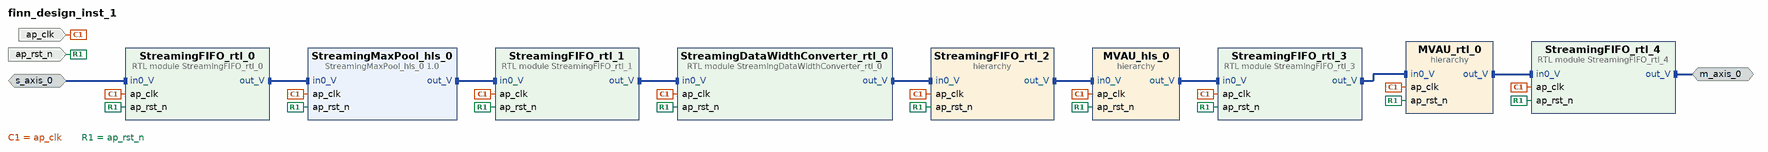
[diagram p0: block diagram of the top level]
# Vivado block design finn_design_inst_1, xc7z020clg400-1, Vivado 2022.2
create_bd_design finn_design_inst_1

create_bd_intf_port -mode Slave -vlnv xilinx.com:interface:axis_rtl:1.0 s_axis_0
create_bd_intf_port -mode Master -vlnv xilinx.com:interface:axis_rtl:1.0 m_axis_0
create_bd_port -dir I -type clk ap_clk
create_bd_port -dir I -type rst ap_rst_n

create_bd_cell -type module -reference StreamingFIFO_rtl_0 StreamingFIFO_rtl_0
create_bd_cell -type ip -vlnv xilinx.com:hls:StreamingMaxPool_hls_0:1.0 StreamingMaxPool_hls_0
create_bd_cell -type module -reference StreamingFIFO_rtl_1 StreamingFIFO_rtl_1
create_bd_cell -type module -reference StreamingDataWidthConverter_rtl_0 StreamingDataWidthConverter_rtl_0
create_bd_cell -type hier StreamingFIFO_rtl_2
create_bd_cell -type hier MVAU_hls_0
create_bd_cell -type module -reference StreamingFIFO_rtl_3 StreamingFIFO_rtl_3
create_bd_cell -type hier MVAU_rtl_0
create_bd_cell -type module -reference StreamingFIFO_rtl_4 StreamingFIFO_rtl_4

# ---- hierarchy /StreamingFIFO_rtl_2 ----
current_bd_instance /StreamingFIFO_rtl_2
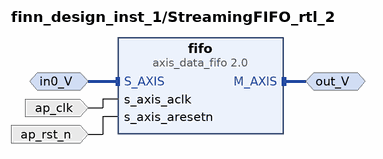
[diagram p1: block diagram inside /StreamingFIFO_rtl_2]
create_bd_intf_pin -mode Master -vlnv xilinx.com:interface:axis_rtl:1.0 out_V
create_bd_intf_pin -mode Slave -vlnv xilinx.com:interface:axis_rtl:1.0 in0_V
create_bd_pin -dir I -type clk ap_clk
create_bd_pin -dir I -type rst ap_rst_n

create_bd_cell -type ip -vlnv xilinx.com:ip:axis_data_fifo:2.0 fifo
set_property -dict {CONFIG.FIFO_DEPTH 512 CONFIG.FIFO_MEMORY_TYPE auto CONFIG.TDATA_NUM_BYTES 8} [get_bd_cells fifo]

# ---- hierarchy /MVAU_hls_0 ----
current_bd_instance /MVAU_hls_0
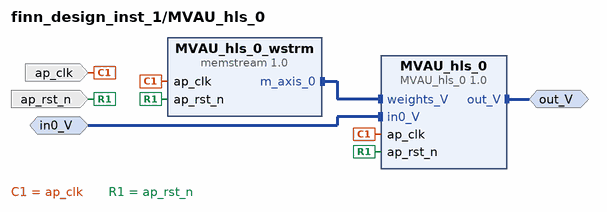
[diagram p2: block diagram inside /MVAU_hls_0]
create_bd_intf_pin -mode Master -vlnv xilinx.com:interface:axis_rtl:1.0 out_V
create_bd_intf_pin -mode Slave -vlnv xilinx.com:interface:axis_rtl:1.0 in0_V
create_bd_pin -dir I -type clk ap_clk
create_bd_pin -dir I -type rst ap_rst_n

create_bd_cell -type ip -vlnv xilinx.com:hls:MVAU_hls_0:1.0 MVAU_hls_0
create_bd_cell -type ip -vlnv amd.com:finn:memstream:1.0 MVAU_hls_0_wstrm
set_property -dict [list \
  CONFIG.DEPTH 12544 \
  CONFIG.INIT_FILE /tmp/finn_dev_andreea/code_gen_ipgen_MVAU_hls_0_wm2359pm/memblock.dat \
  CONFIG.RAM_STYLE auto \
  CONFIG.WIDTH 64 \
] [get_bd_cells MVAU_hls_0_wstrm]

# ---- hierarchy /MVAU_rtl_0 ----
current_bd_instance /MVAU_rtl_0
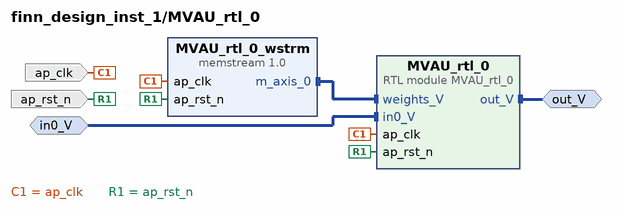
[diagram p3: block diagram inside /MVAU_rtl_0]
create_bd_intf_pin -mode Master -vlnv xilinx.com:interface:axis_rtl:1.0 out_V
create_bd_intf_pin -mode Slave -vlnv xilinx.com:interface:axis_rtl:1.0 in0_V
create_bd_pin -dir I -type clk ap_clk
create_bd_pin -dir I -type rst ap_rst_n

create_bd_cell -type module -reference MVAU_rtl_0 MVAU_rtl_0
create_bd_cell -type ip -vlnv amd.com:finn:memstream:1.0 MVAU_rtl_0_wstrm
set_property -dict [list \
  CONFIG.DEPTH 320 \
  CONFIG.INIT_FILE /tmp/finn_dev_andreea/code_gen_ipgen_MVAU_rtl_0_sk01edbv/memblock.dat \
  CONFIG.RAM_STYLE auto \
  CONFIG.WIDTH 8 \
] [get_bd_cells MVAU_rtl_0_wstrm]

# ---- connections ----

current_bd_instance /StreamingFIFO_rtl_2
connect_bd_intf_net [get_bd_intf_pins out_V] [get_bd_intf_pins fifo/M_AXIS]
connect_bd_intf_net [get_bd_intf_pins in0_V] [get_bd_intf_pins fifo/S_AXIS]
connect_bd_net [get_bd_pins ap_clk] [get_bd_pins fifo/s_axis_aclk]
connect_bd_net [get_bd_pins ap_rst_n] [get_bd_pins fifo/s_axis_aresetn]

current_bd_instance /MVAU_hls_0
connect_bd_intf_net [get_bd_intf_pins out_V] [get_bd_intf_pins MVAU_hls_0/out_V]
connect_bd_intf_net [get_bd_intf_pins MVAU_hls_0_wstrm/m_axis_0] [get_bd_intf_pins MVAU_hls_0/weights_V]
connect_bd_intf_net [get_bd_intf_pins in0_V] [get_bd_intf_pins MVAU_hls_0/in0_V]
connect_bd_net [get_bd_pins ap_clk] [get_bd_pins MVAU_hls_0_wstrm/ap_clk] [get_bd_pins MVAU_hls_0/ap_clk]
connect_bd_net [get_bd_pins ap_rst_n] [get_bd_pins MVAU_hls_0_wstrm/ap_rst_n] [get_bd_pins MVAU_hls_0/ap_rst_n]

current_bd_instance /MVAU_rtl_0
connect_bd_intf_net [get_bd_intf_pins out_V] [get_bd_intf_pins MVAU_rtl_0/out_V]
connect_bd_intf_net [get_bd_intf_pins MVAU_rtl_0_wstrm/m_axis_0] [get_bd_intf_pins MVAU_rtl_0/weights_V]
connect_bd_intf_net [get_bd_intf_pins in0_V] [get_bd_intf_pins MVAU_rtl_0/in0_V]
connect_bd_net [get_bd_pins ap_clk] [get_bd_pins MVAU_rtl_0_wstrm/ap_clk] [get_bd_pins MVAU_rtl_0/ap_clk]
connect_bd_net [get_bd_pins ap_rst_n] [get_bd_pins MVAU_rtl_0_wstrm/ap_rst_n] [get_bd_pins MVAU_rtl_0/ap_rst_n]

current_bd_instance /
connect_bd_intf_net [get_bd_intf_pins MVAU_hls_0/out_V] [get_bd_intf_pins StreamingFIFO_rtl_3/in0_V]
connect_bd_intf_net [get_bd_intf_pins MVAU_rtl_0/out_V] [get_bd_intf_pins StreamingFIFO_rtl_4/in0_V]
connect_bd_intf_net [get_bd_intf_pins StreamingDataWidthConverter_rtl_0/out_V] [get_bd_intf_pins StreamingFIFO_rtl_2/in0_V]
connect_bd_intf_net [get_bd_intf_pins StreamingFIFO_rtl_0/out_V] [get_bd_intf_pins StreamingMaxPool_hls_0/in0_V]
connect_bd_intf_net [get_bd_intf_pins StreamingFIFO_rtl_1/out_V] [get_bd_intf_pins StreamingDataWidthConverter_rtl_0/in0_V]
connect_bd_intf_net [get_bd_intf_pins StreamingFIFO_rtl_2/out_V] [get_bd_intf_pins MVAU_hls_0/in0_V]
connect_bd_intf_net [get_bd_intf_pins StreamingFIFO_rtl_3/out_V] [get_bd_intf_pins MVAU_rtl_0/in0_V]
connect_bd_intf_net [get_bd_intf_ports m_axis_0] [get_bd_intf_pins StreamingFIFO_rtl_4/out_V]
connect_bd_intf_net [get_bd_intf_pins StreamingMaxPool_hls_0/out_V] [get_bd_intf_pins StreamingFIFO_rtl_1/in0_V]
connect_bd_intf_net -intf_net in0_V_0_1 [get_bd_intf_ports s_axis_0] [get_bd_intf_pins StreamingFIFO_rtl_0/in0_V]
connect_bd_net -net ap_clk_0_1 [get_bd_ports ap_clk] \
  [get_bd_pins StreamingFIFO_rtl_0/ap_clk] [get_bd_pins StreamingMaxPool_hls_0/ap_clk] \
  [get_bd_pins StreamingFIFO_rtl_1/ap_clk] [get_bd_pins StreamingDataWidthConverter_rtl_0/ap_clk] \
  [get_bd_pins StreamingFIFO_rtl_2/ap_clk] [get_bd_pins MVAU_hls_0/ap_clk] [get_bd_pins StreamingFIFO_rtl_3/ap_clk] \
  [get_bd_pins MVAU_rtl_0/ap_clk] [get_bd_pins StreamingFIFO_rtl_4/ap_clk]
connect_bd_net -net ap_rst_n_0_1 [get_bd_ports ap_rst_n] \
  [get_bd_pins StreamingFIFO_rtl_0/ap_rst_n] [get_bd_pins StreamingMaxPool_hls_0/ap_rst_n] \
  [get_bd_pins StreamingFIFO_rtl_1/ap_rst_n] [get_bd_pins StreamingDataWidthConverter_rtl_0/ap_rst_n] \
  [get_bd_pins StreamingFIFO_rtl_2/ap_rst_n] [get_bd_pins MVAU_hls_0/ap_rst_n] [get_bd_pins StreamingFIFO_rtl_3/ap_rst_n] \
  [get_bd_pins MVAU_rtl_0/ap_rst_n] [get_bd_pins StreamingFIFO_rtl_4/ap_rst_n]

validate_bd_design
save_bd_design
